# EAGLE design xmega_ethernet (EAGLE 6.6.0)
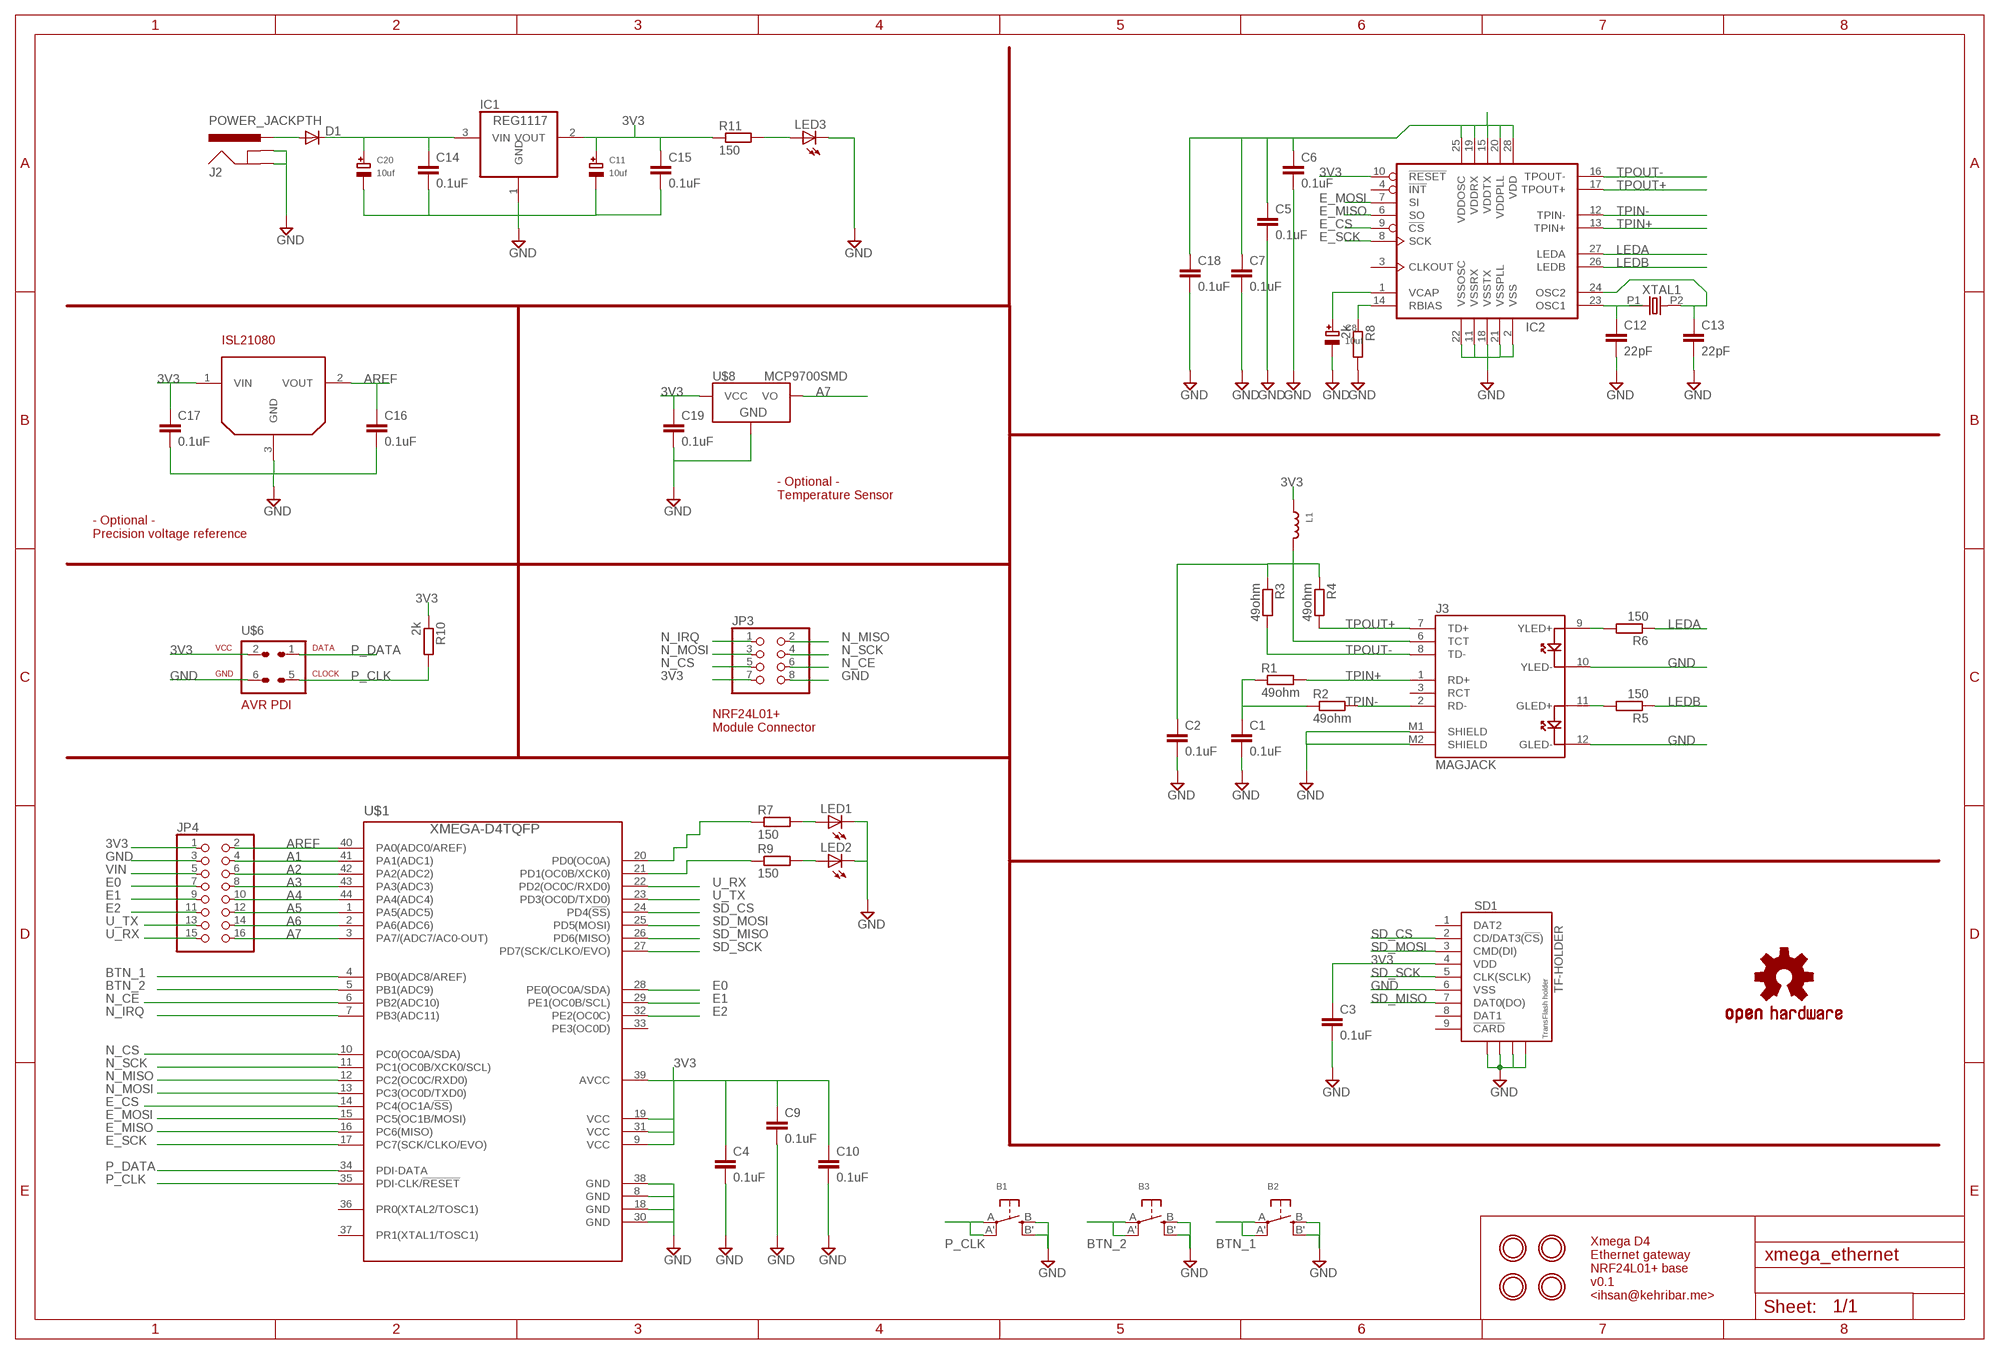
[diagram p0: schematic, sheet 1]

## Parts
B1  SWITCH_TACT_SMT4.6X2.8  [BTN_KMR2_4.6X2.8]
B2  SWITCH_TACT_SMT4.6X2.8  [BTN_KMR2_4.6X2.8]
B3  SWITCH_TACT_SMT4.6X2.8  [BTN_KMR2_4.6X2.8]
C1  0.1uF  C-EUC0805  [C0805]
C2  0.1uF  C-EUC0805  [C0805]
C3  0.1uF  C-EUC0805  [C0805]
C4  0.1uF  C-EUC0805  [C0805]
C5  0.1uF  C-EUC0805  [C0805]
C6  0.1uF  C-EUC0805  [C0805]
C7  0.1uF  C-EUC0805  [C0805]
C8  10uf  CAP_TANTALUMB/3528_WAVE  [EIA3528-21/B-W]
C9  0.1uF  C-EUC0805  [C0805]
C10  0.1uF  C-EUC0805  [C0805]
C11  10uf  CAP_TANTALUMB/3528_WAVE  [EIA3528-21/B-W]
C12  22pF  C-EUC0805  [C0805]
C13  22pF  C-EUC0805  [C0805]
C14  0.1uF  C-EUC0805  [C0805]
C15  0.1uF  C-EUC0805  [C0805]
C16  0.1uF  C-EUC0805  [C0805]
C17  0.1uF  C-EUC0805  [C0805]
C18  0.1uF  C-EUC0805  [C0805]
C19  0.1uF  C-EUC0805  [C0805]
C20  10uf  CAP_TANTALUMB/3528_WAVE  [EIA3528-21/B-W]
D1  DIODE1N4148  [DIODE-1N4148]
IC1  REG1117  [SOT223]
IC2  IC_ENC28J60-SOIC-28  [SOIC-28W]
J2  POWER_JACKPTH  [POWER_JACK_PTH]
J3  MAGJACK  [MAGJACK]
JP3  PINHD-2X4  [2X04]
JP4  PINHD-2X8  [2X08]
L1  INDUCTOR0805  [0805]
LED1  LED-0805  [LED-805]
LED2  LED-0805  [LED-805]
LED3  LED-0805  [LED-805]
LOGO1  OSHW-LOGOM  [OSHW-LOGO-M]
R1  49ohm  R-EU_R0805  [R0805]
R2  49ohm  R-EU_R0805  [R0805]
R3  49ohm  R-EU_R0805  [R0805]
R4  49ohm  R-EU_R0805  [R0805]
R5  150  R-EU_R0805  [R0805]
R6  150  R-EU_R0805  [R0805]
R7  150  R-EU_R0805  [R0805]
R8  2k  R-EU_R0805  [R0805]
R9  150  R-EU_R0805  [R0805]
R10  2k  R-EU_R0805  [R0805]
R11  150  R-EU_R0805  [R0805]
SD1  TF-HOLDER  [TF-PULL]
U$1  XMEGA-D4TQFP  [TQFP44]
U$2  MOUNTINGHOLE3.0THIN  [MOUNTINGHOLE_3.0_PLATEDTHIN]
U$3  MOUNTINGHOLE3.0THIN  [MOUNTINGHOLE_3.0_PLATEDTHIN]
U$4  MOUNTINGHOLE3.0THIN  [MOUNTINGHOLE_3.0_PLATEDTHIN]
U$5  MOUNTINGHOLE3.0THIN  [MOUNTINGHOLE_3.0_PLATEDTHIN]
U$6  AVR-PDIVERT  [AVR-ISP-6]
U$7  IHSAN_ISL21080  [SOT23-3]
U$8  MCP9700SMD  [SOT23-3]
XTAL1  OSC-XTAL-HC-49U-PTH  [HC-49U-PTH]

## Nets
3V3: C3.1 C4.1 C5.1 C6.1 C7.1 C9.1 C10.1 C11.+ C15.1 C17.1 C18.1 C19.1 IC1.2(VOUT) IC2.10(!RESET) IC2.15(VDDTX) IC2.19(VDDRX) IC2.20(VDDPLL) IC2.25(VDDOSC) IC2.28(VDD) JP3.7 JP4.1 L1.1 R10.1 R11.1 SD1.4(VDD) U$1.9(VCC) U$1.19(VCC) U$1.31(VCC) U$1.39(AVCC) U$6.2 U$7.1(VIN) U$8.1(VCC)
A1: JP4.4 U$1.41(PA1(ADC1))
A2: JP4.6 U$1.42(PA2(ADC2))
A3: JP4.8 U$1.43(PA3(ADC3))
A4: JP4.10 U$1.44(PA4(ADC4))
A5: JP4.12 U$1.1(PA5(ADC5))
A6: JP4.14 U$1.2(PA6(ADC6))
A7: JP4.16 U$1.3(PA7/(ADC7/AC0-OUT)) U$8.2(VO)
AREF: C16.1 JP4.2 U$1.40(PA0(ADC0/AREF)) U$7.2(VOUT)
BTN_1: B2.A'(P1) B2.A(P) U$1.4(PB0(ADC8/AREF))
BTN_2: B3.A'(P1) B3.A(P) U$1.5(PB1(ADC9))
E0: JP4.7 U$1.28(PE0(OC0A/SDA))
E1: JP4.9 U$1.29(PE1(OC0B/SCL))
E2: JP4.11 U$1.32(PE2(OC0C))
E_CS: IC2.9(!CS) U$1.14(PC4(OC1A/!SS!))
E_MISO: IC2.6(SO) U$1.16(PC6(MISO))
E_MOSI: IC2.7(SI) U$1.15(PC5(OC1B/MOSI))
E_SCK: IC2.8(SCK) U$1.17(PC7(SCK/CLKO/EVO))
GND: B1.B'(S1) B1.B(S) B2.B'(S1) B2.B(S) B3.B'(S1) B3.B(S) C1.2 C2.2 C3.2 C4.2 C5.2 C6.2 C7.2 C8.- C9.2 C10.2 C11.- C12.2 C13.2 C14.2 C15.2 C16.2 C17.2 C18.2 C19.2 C20.- IC1.1(GND) IC2.2(VSS) IC2.11(VSSRX) IC2.18(VSSTX) IC2.21(VSSPLL) IC2.22(VSSOSC) J2.GND J2.GNDBREAK J3.10(YLED-) J3.12(GLED-) J3.M1(SHIELD) J3.M2(SHIELD) JP3.8 JP4.3 LED1.C LED2.C LED3.C R8.2 SD1.6(VSS) SD1.S1 SD1.S2 SD1.S3 SD1.S4 U$1.8(GND) U$1.18(GND) U$1.30(GND) U$1.38(GND) U$6.6 U$7.3(GND) U$8.3(GND)
LEDA: IC2.27(LEDA) R6.1
LEDB: IC2.26(LEDB) R5.1
N$1: C1.1 R1.1 R2.1
N$2: J3.9(YLED+) R6.2
N$3: C13.1 IC2.24(OSC2) XTAL1.P2
N$4: J3.11(GLED+) R5.2
N$5: C12.1 IC2.23(OSC1) XTAL1.P1
N$7: C2.1 J3.6(TCT) L1.2 R3.1 R4.1
N$10: C8.+ IC2.1(VCAP)
N$13: IC2.14(RBIAS) R8.1
N$17: R7.1 U$1.20(PD0(OC0A))
N$18: R9.1 U$1.21(PD1(OC0B/XCK0))
N$19: LED1.A R7.2
N$20: LED2.A R9.2
N$21: D1.A J2.PWR
N$24: LED3.A R11.2
N_CE: JP3.6 U$1.6(PB2(ADC10))
N_CS: JP3.5 U$1.10(PC0(OC0A/SDA))
N_IRQ: JP3.1 U$1.7(PB3(ADC11))
N_MISO: JP3.2 U$1.12(PC2(OC0C/RXD0))
N_MOSI: JP3.3 U$1.13(PC3(OC0D/TXD0))
N_SCK: JP3.4 U$1.11(PC1(OC0B/XCK0/SCL))
P_CLK: B1.A'(P1) B1.A(P) R10.2 U$1.35(PDI-CLK/!RESET) U$6.5
P_DATA: U$1.34(PDI-DATA) U$6.1
SD_CS: SD1.2(CD/DAT3(!CS!)) U$1.24(PD4(!SS!))
SD_MISO: SD1.7(DAT0(DO)) U$1.26(PD6(MISO))
SD_MOSI: SD1.3(CMD(DI)) U$1.25(PD5(MOSI))
SD_SCK: SD1.5(CLK(SCLK)) U$1.27(PD7(SCK/CLKO/EVO))
TPIN+: IC2.13(TPIN+) J3.1(RD+) R1.2
TPIN-: IC2.12(TPIN-) J3.2(RD-) R2.2
TPOUT+: IC2.17(TPOUT+) J3.7(TD+) R4.2
TPOUT-: IC2.16(TPOUT-) J3.8(TD-) R3.2
U_RX: JP4.15 U$1.22(PD2(OC0C/RXD0))
U_TX: JP4.13 U$1.23(PD3(OC0D/TXD0))
VIN: C14.1 C20.+ D1.C IC1.3(VIN) JP4.5
Unconnected: IC2.3(CLKOUT) IC2.4(!INT) J3.3(RCT) SD1.1(DAT2) SD1.8(DAT1) SD1.9(!CARD) U$1.33(PE3(OC0D)) U$1.36(PR0(XTAL2/TOSC1)) U$1.37(PR1(XTAL1/TOSC1))

## Notes on the sheet
- - Optional -
  Temperature Sensor
- - Optional -
  Precision voltage reference
- NRF24L01+
  Module Connector
- Xmega D4 
  Ethernet gateway
  NRF24L01+ base
  v0.1
  <ihsan@kehribar.me>

## Library data of the parts
B1-B3 = microbuilder:SWITCH_TACT_SMT: SMT Tact Switches 6x6mm - Digikey: P12940SCT-ND KMR2 (4.6x2.8mm) - Digikey: 401-1426-1-ND EVQ-PQHB55 - Light Touch, 160GF (4.5x4.5mm) - Digikey: P8090SCT-ND
C1-C7 C9 C10 C12-C19 = rcl:C-EU: CAPACITOR, European symbol
C8 C11 C20 = microbuilder:CAP_TANTALUM: Tantalum Capacitors Wave footprints have larger pads and are meant to be used for hand soldering. Reflow footprints are optimised for solder paste and a reflow oven. EIA3216-18/A-[R/W] - Size A / 3216-18 / 1206 footprint 4.7µF 25V 10% Tantalum Capacitor 10µF 16V 10% Tantalum Capacitor [Digikey: 495-2236-2-ND] EIA3528-21/B-[R/W] - Size B / 3528-21 47µF 10V 10% Tantalum Capactior [Digikey: 495-2216-1-ND] EIA6032-28/C-[R/W] - Size C / 6032-28 10µF 35V 20% Tantalum Capacitor [Digikey: 495-2285-1-ND] 100µF 16V 10% Tantalum Capactior [Digikey: 399-5214-1-ND]
D1 = SparkFun-DiscreteSemi:DIODE: Diode These are standard reverse protection diodes and small signal diodes. SMA package can handle up to about 1A. SOD-323 can handle about 200mA. What the SOD-323 package when ordering, there are some mfgs out there that are 5-pin packages.
IC1 = burr-brown:REG1117: 800mA and 1A Low Dropout (LDO) Positive Regulator 1.8V, 2.5V, 2.85V, 3.3V, 5V, and Adj; MPN: REG1117; OC_FARNELL: 1097566; OC_NEWARK: 14P6981
IC2 = dp_devices:IC_ENC28J60: Ethernet Controller with SPI Interface
J2 = SparkFun-Connectors:POWER_JACK: Power Jack This is the standard 5.5mm barrel jack for power. The PTH is the most common, proven, reliable, footprint. The Slot footprint only works if the mill layer is transmitted to the PCB fab house so be warned. Spark Fun Electronics SKU : PRT-00119 SMT: CONN-08106 Mating wall wart : TOL-00298 (and others)
J3 = SparkFun-Connectors:MAGJACK: RJ-45 with LEDs
JP3 = pinhead:PINHD-2X4: PIN HEADER
JP4 = pinhead:PINHD-2X8: PIN HEADER
L1 = microbuilder:INDUCTOR: Inductors 0603: 10nH Ceramic Inductor - microwire antenna/RF (Digikey: 712-1434-2-ND) 0805: 560nH Ceramic Inductor - RF (Digikey: 553-1047-1-ND) 270nH Ceramic Inductor - Q = 40@250MHz, +-5%, 1 Ohm DC Resistance (Digikey: 535-10506-2-ND) 1007 (2518 Metric) SMT: 10µH 10% 250mOhm 820mA 1007 Inductor (Digikey: 587-2189-1-ND) 22µH 10% 500mOhm 580mA 1007 Inductor (Digikey: 587-2190-1-ND) 47µH 10% 950mOhm 420mA 1007 Inductor (Digikey: 587-2191-1-ND) 47µH 5% 100mOhm 1A 1008 Inductor (Digikey: 732-1816-1-ND) 5.0x5.0mm (Taiyo Yuden NR5040 Series) 6.8µH 20% 2.3A 64mOhm Inductor (Digikey: 587-2374-2-ND) 5.0x5.0mm (TDK VLC5045 Series) 4.7µH 20% 3.3A 34mOhm Inductor (Digikey: 445-6526-1-ND) 6.8µH 20% 2.7A 46mOhm Inductor (Digikey: 445-6527-1-ND) 6.0x6.0mm (TDK VLC6045 Series) 4.7µH 20% 3.8A 27mOhm Inductor (Digikey: 445-6538-2-ND) 6.8µH 20% 3A 41mOhm Inductor (Digikey: 445-6540-1-ND) 6.2µH 30% 2.2A 45mOhm Inductor (Digikey: SRR5028-6R2YCT-ND) - Not TDK VLC6045 but footprint should match 6.0x6.0mm (TDK SLF6045 Series) 6.8uH 30% 2A 33mOhm Inductor (Digikey: 445-4572-1-ND, Mouser: 810-SLF645T6R8N2R0PF)
LED1-LED3 = dp_devices:LED: Light Emitting Diode
LOGO1 = SparkFun-Aesthetics:OSHW-LOGO: Open Source Hardware Logo This logo indicates the piece of hardware it is found on incorporates a OSHW license and/or adheres to the definition of open source hardware found here: http://freedomdefined.org/OSHW
R1-R11 = rcl:R-EU_: RESISTOR, European symbol
SD1 = transflash:TF-HOLDER: TF / Micro SD socket is PUSH-PUSH type, the card can be pushed into and auto locked and pushed out by simply press the card. Surface Mounting type.
U$1 = avr-7:XMEGA-D4: Atmel AVR XMega D4 series processor
U$2-U$5 = microbuilder:MOUNTINGHOLE: Mounting Hole For #2 screws (0.086"/2.18mm width, 0.094"/2.4mm hole) use 2.5mm
U$6 = avr-7:AVR-PDI: AVR PDI programming interface connector
U$7 = SparkFun-DigitalIC_ihsan:IHSAN_ISL21080
U$8 = SparkFun-Sensors:MCP9700: Analog-output temperature sensor
XTAL1 = dp_devices:OSC-XTAL

## Board
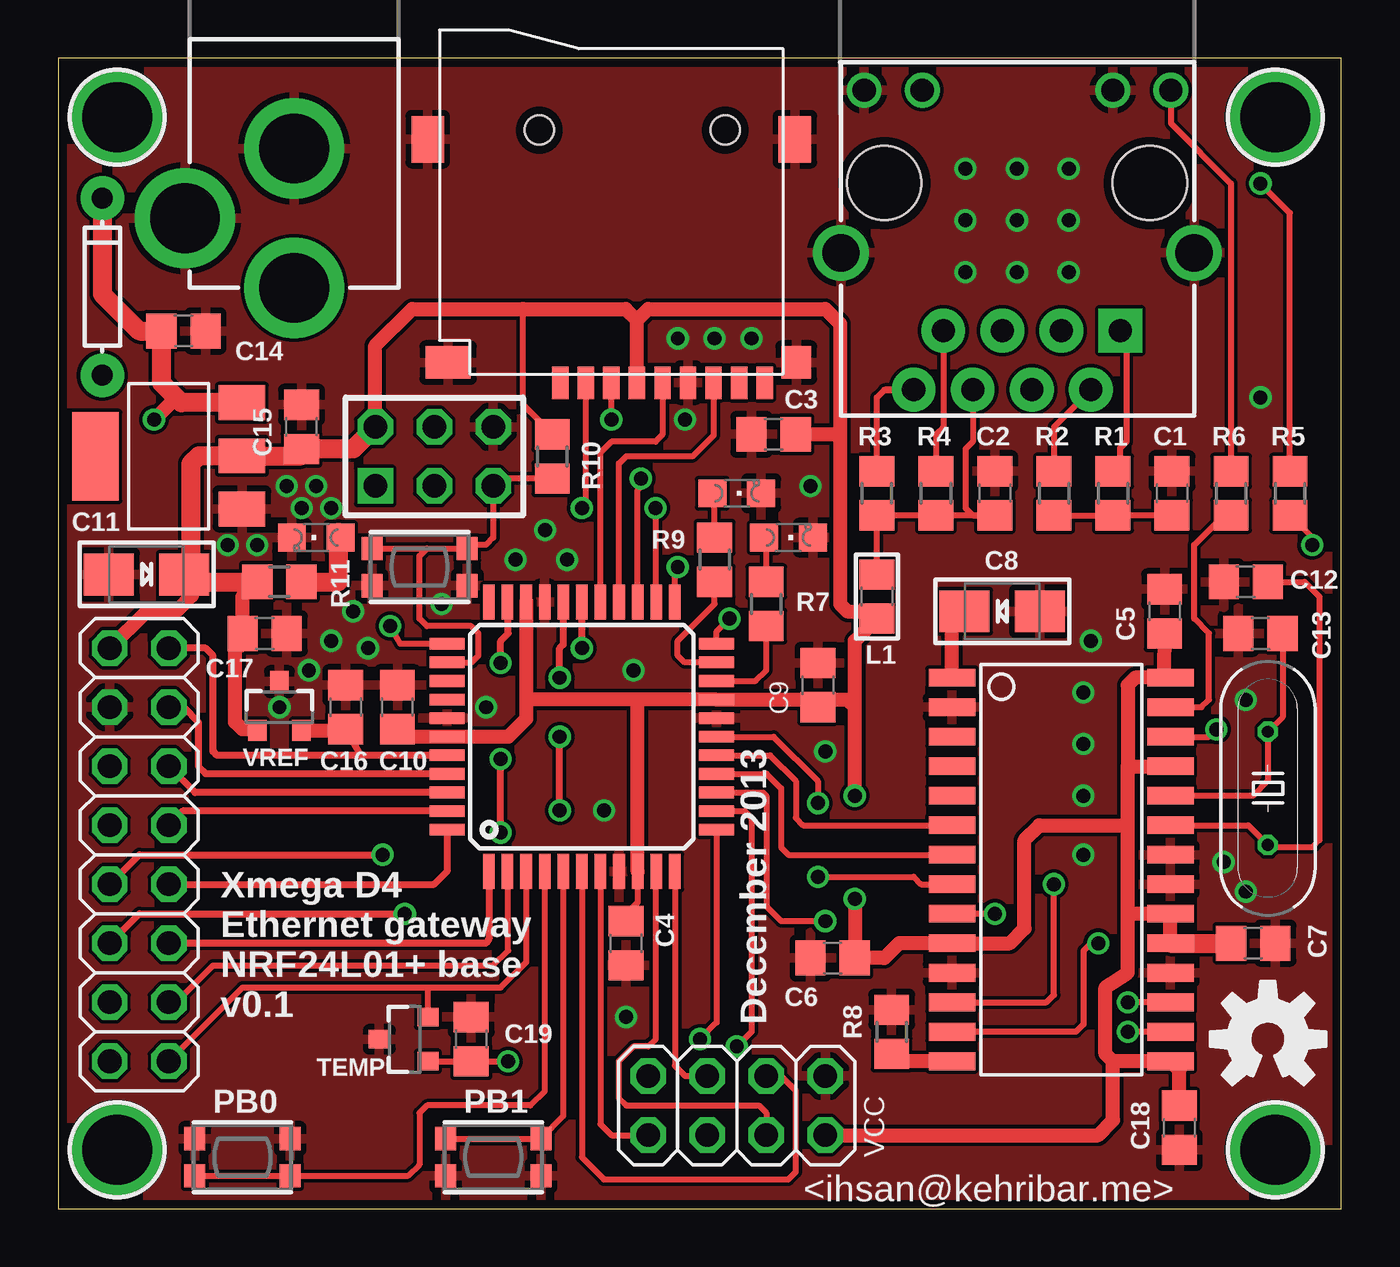
[diagram p1: board, top side]
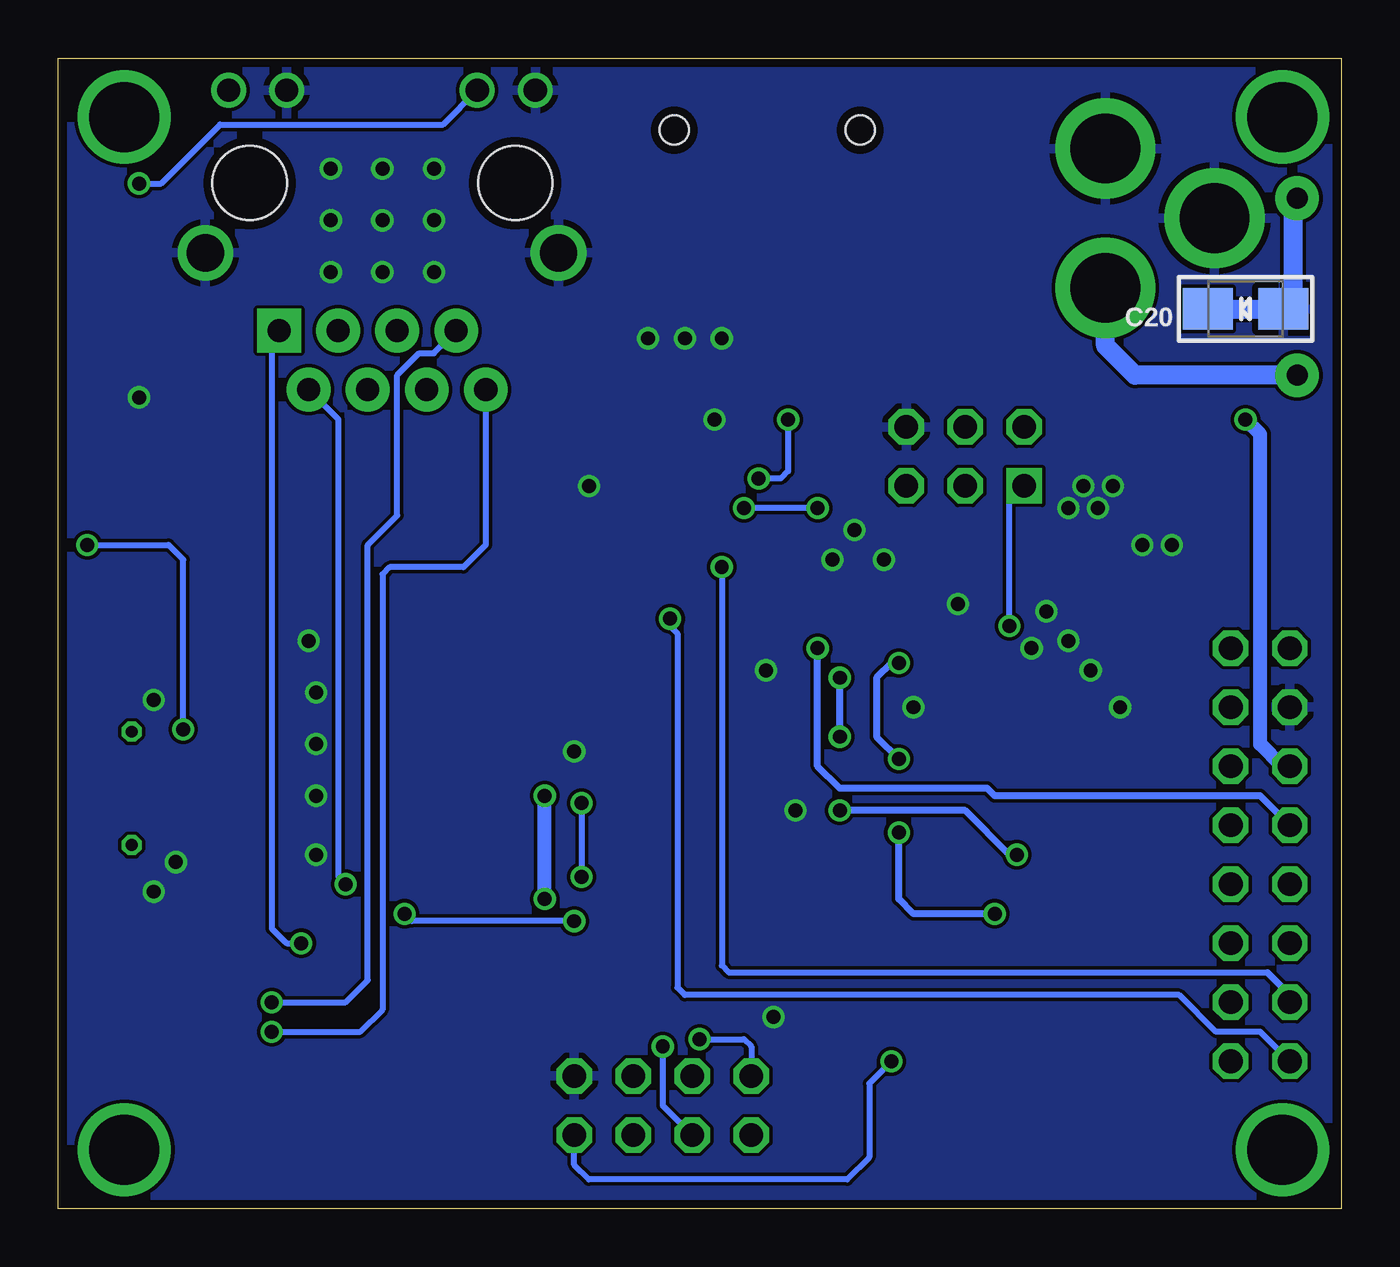
[diagram p2: board, bottom side, seen from below]

Size 55.23 x 49.52 mm. Coordinates in mm from the lower left corner, seen from the top.
Outline: 0,49.52 0,0 55.23,0 55.23,49.52 0,49.52
Copper layers (1*16): Top 0.0356mm / dielectric 1.5011mm / Bottom 0.0356mm
Design rules "LaenPCBOrder": minimum track width 6mil, minimum drill 13mil, track to track 6mil, track to pad 6mil, pad to pad 6mil, via to via 6mil, smd to smd 6mil, copper to edge 15mil, drill to drill 6mil, minimum pad ring 7mil, minimum via ring 7mil, stop-mask expansion 4mil, vias tented up to drill 0mil, thermal gap 10mil

### Footprints (pad centres in the part's own frame; a part is rotated, then mirrored left to right if it is on the bottom)
BTN_KMR2_4.6X2.8 = smd 0.9 x 1: A 2.05,0.8; A' -2.05,0.8; B 2.05,-0.8; B' -2.05,-0.8
C0805 = smd 1.3 x 1.5: 1 -0.95,0; 2 0.95,0
EIA3528-21/B-W = smd 2.15 x 1.8: + 1.625,0; - -1.625,0
DIODE-1N4148 = drill 0.9 pad 1.88: A -3.81,0; C 3.81,0
SOT223 = smd 1.499 x 2.007: 1 -2.261,-3.15; 2 0.025,-3.15; 3 2.311,-3.15 | smd 3.81 x 2.007: 4 0,3.15
SOIC-28W = smd 0.762 x 2: 1 -8.89,-4.7; 2 -7.62,-4.7; 3 -6.35,-4.7; 4 -5.08,-4.7; 5 -3.81,-4.7; 6 -2.54,-4.7; 7 -1.27,-4.7; 8 0,-4.7; 9 1.27,-4.7; 10 2.54,-4.7; 11 3.81,-4.7; 12 5.08,-4.7; 13 6.35,-4.7; 14 7.62,-4.7; 15 7.62,4.7; 16 6.35,4.7; 17 5.08,4.7; 18 3.81,4.7; 19 2.54,4.7; 20 1.27,4.7; 21 0,4.7; 22 -1.27,4.7; 23 -2.54,4.7; 24 -3.81,4.7; 25 -5.08,4.7; 26 -6.35,4.7; 27 -7.62,4.7; 28 -8.89,4.7
POWER_JACK_PTH = drill 2.997 pad 4.318: GND 0,7.7; GNDBREAK 4.7,10.7; PWR 0,13.7
MAGJACK = drill 1 pad 1.88 square: 1 3.175,17.445 | drill 1 pad 1.88: 2 4.445,19.985; 3 5.715,17.445; 4 6.985,19.985; 5 8.255,17.445; 6 9.525,19.985; 7 10.795,17.445; 8 12.065,19.985 | drill 1 pad 1.27: 9 1,7.1; 10 3.5,7.1; 11 11.7,7.1; 12 14.2,7.1 | drill 1.6 pad 2.184: M1 0,14.1; M2 15.2,14.1 | hole 3.2: 1.905,11.095; 13.335,11.095
2X04 = drill 1.016 octagon: 1 -3.81,-1.27; 2 -3.81,1.27; 3 -1.27,-1.27; 4 -1.27,1.27; 5 1.27,-1.27; 6 1.27,1.27; 7 3.81,-1.27; 8 3.81,1.27
2X08 = drill 1.016 octagon: 1 -8.89,-1.27; 2 -8.89,1.27; 3 -6.35,-1.27; 4 -6.35,1.27; 5 -3.81,-1.27; 6 -3.81,1.27; 7 -1.27,-1.27; 8 -1.27,1.27; 9 1.27,-1.27; 10 1.27,1.27; 11 3.81,-1.27; 12 3.81,1.27; 13 6.35,-1.27; 14 6.35,1.27; 15 8.89,-1.27; 16 8.89,1.27
0805 = smd 1.3 x 1.5: 1 -0.95,0; 2 0.95,0
LED-805 = smd 1.2 x 1.2: A 0,-1.05; C 0,1.05
R0805 = smd 1.3 x 1.5: 1 -0.95,0; 2 0.95,0
TF-PULL = smd 0.7 x 1.4: 1 -2.2,-7.62; 2 -1.1,-7.62; 3 0,-7.62; 4 1.1,-7.62; 5 2.2,-7.62; 6 3.3,-7.62; 7 4.4,-7.62; 8 5.5,-7.62; 9 6.6,-7.62 | smd 1.4 x 2: S1 -7.9,2.85; S2 7.9,2.85 | smd 1.28 x 1.4: S3 7.96,-6.75 | smd 1.95 x 1.4: S4 -7.025,-6.75 | hole 1.25: -3.1,3.25; 4.9,3.25
TQFP44 = smd 1.5 x 0.5: 1 -5.8,4; 2 -5.8,3.2; 3 -5.8,2.4; 4 -5.8,1.6; 5 -5.8,0.8; 6 -5.8,0; 7 -5.8,-0.8; 8 -5.8,-1.6; 9 -5.8,-2.4; 10 -5.8,-3.2; 11 -5.8,-4; 23 5.8,-4; 24 5.8,-3.2; 25 5.8,-2.4; 26 5.8,-1.6; 27 5.8,-0.8; 28 5.8,0; 29 5.8,0.8; 30 5.8,1.6; 31 5.8,2.4; 32 5.8,3.2; 33 5.8,4 | smd 0.5 x 1.5: 12 -4,-5.8; 13 -3.2,-5.8; 14 -2.4,-5.8; 15 -1.6,-5.8; 16 -0.8,-5.8; 17 0,-5.8; 18 0.8,-5.8; 19 1.6,-5.8; 20 2.4,-5.8; 21 3.2,-5.8; 22 4,-5.8; 34 4,5.8; 35 3.2,5.8; 36 2.4,5.8; 37 1.6,5.8; 38 0.8,5.8; 39 0,5.8; 40 -0.8,5.8; 41 -1.6,5.8; 42 -2.4,5.8; 43 -3.2,5.8; 44 -4,5.8
MOUNTINGHOLE_3.0_PLATEDTHIN = drill 3 pad 3.6: P$1 0,0
AVR-ISP-6 = drill 1.016 square: 1 -2.54,-1.27 | drill 1.016 octagon: 2 -2.54,1.27; 3 0,-1.27; 4 0,1.27; 5 2.54,-1.27; 6 2.54,1.27
SOT23-3 = smd 0.8 x 0.9: 1 -0.95,-1; 2 0.95,-1; 3 0,1.1
HC-49U-PTH = drill 0.508 octagon: P1 -2.44,0; P2 2.44,0

### Placement (x,y rotation side)
B1  15.56,27.61 0 top
B2  7.94,2.21 180 top
B3  18.73,2.21 0 top
C1  47.94,30.79 90 top
C2  40.32,30.79 90 top
C3  30.8,33.32 180 top
C4  24.45,11.42 270 top
C5  47.62,25.71 90 top
C6  33.34,10.78 180 top
C7  51.44,11.42 0 top
C8  40.64,25.71 180 top
C9  32.7,22.53 90 top
C10  14.61,21.58 90 top
C11  3.81,27.29 0 top
C12  51.12,26.98 180 top
C13  51.75,24.75 180 top
C14  5.4,37.77 0 top
C15  10.48,33.64 90 top
C16  12.38,21.58 90 top
C17  8.89,24.75 0 top
C18  48.26,3.48 270 top
C19  17.78,7.29 90 top
C20  4.13,38.72 180 bottom
D1  1.91,39.67 90 top
IC1  4.76,32.37 90 top
IC2  43.18,13.96 270 top
J2  10.16,53.33 180 top
J3  48.9,55.23 180 top
JP3  29.21,4.43 0 top
JP4  3.49,15.23 270 top
L1  35.24,26.34 90 top
LED1  31.43,28.88 270 top
LED2  29.21,30.79 270 top
LED3  11.11,28.88 90 top
LOGO1  52.07,7.29 0 top
R1  45.4,30.79 90 top
R2  42.86,30.79 90 top
R3  35.24,30.79 90 top
R4  37.78,30.79 90 top
R5  53.02,30.79 90 top
R6  50.48,30.79 90 top
R7  30.48,26.02 90 top
R8  35.88,7.61 90 top
R9  28.26,27.93 90 top
R10  21.27,32.37 270 top
R11  9.53,26.98 0 top
SD1  23.81,43.17 0 top
U$1  22.54,20.31 90 top
U$2  2.54,46.98 270 top
U$3  52.39,46.98 270 top
U$4  2.54,2.53 270 top
U$5  52.39,2.53 270 top
U$6  16.19,32.37 0 top
U$7  9.53,21.58 0 top
U$8  14.92,7.29 90 top
XTAL1  52.07,18.09 90 top

### Tracks (layer width: path | path; a pad name or v marks a point on that pad's centre or on a via)
3V3  (via drill 0.6)
  Top 0.254: 47.62,23.1 IC2.28 | L1.1 34.93,25.71 | 20.16,21.91 20.14,21.89 | 24.94,21.73 24.77,21.91 | C4.1 24.45,12.69 24.94,13.18 U$1.9 | 14.93,20.31 C10.1 | C9.1 32.7,21.91 | R10.1 20,34.6 20,38.72 | U$7.1 8.3,20.58 8.57,20.62 | 8.26,24.43 C17.1 | U$8.1 C19.1 19.05,6.34 v19.37,6.34
  Top 0.61: IC2.28 46.35,22.85 46.04,22.53 46.04,19.04 | 46.04,19.04 IC2.25 | IC2.19 IC2.20 46.04,12.69 | 46.04,12.69 46.04,10.15 45.09,9.51 45.09,6.66 45.4,6.34 | 46.04,12.69 46.04,16.5 | 46.04,16.5 46.04,19.04 | 45.4,6.34 IC2.15 48.26,5.96 C18.1 | 47.62,23.1 C5.1 | L1.1 34.29,24.44 34.29,21.58 | U$1.31 20.14,21.89 20.14,21.08 19.37,20.31 U$1.39 14.93,20.31 | 20.16,21.91 24.77,21.91 U$1.19 32.7,21.91 33.96,21.91 34.29,21.58 | U$1.9 24.94,21.73 | SD1.4 24.91,38.24 | 24.91,38.24 25.4,38.72 33.02,38.72 33.66,38.09 33.66,33.32 | 33.66,33.32 33.66,26.02 33.97,25.71 34.93,25.71 | v34.29,17.77 34.29,21.58 | C3.1 33.66,33.32 | v34.29,13.32 C6.1 35.56,10.78 36.2,11.42 IC2.10 40.96,11.42 41.59,12.05 41.59,15.86 42.23,16.5 46.04,16.5 | JP3.7 44.77,3.16 45.4,3.8 45.4,6.34 | U$6.2 13.65,37.14 15.24,38.72 20,38.72 24.43,38.72 24.91,38.24 | JP4.1 3.81,25.71 5.08,25.71 5.75,26.38 C11.+ | 8.57,20.62 7.94,20.62 7.62,20.94 7.62,24.12 8.26,24.43 | C17.1 7.94,26.34 R11.1
  Top 0.813: IC2.19 C7.1 | U$6.2 12.7,32.69 C15.1 10.46,32.4 IC1.2 6.06,32.4 5.71,32.06 5.71,27.33 C11.+ 5.75,27.25 6.03,26.98 R11.1
  Bottom 0.254: v19.37,6.34 20.32,5.38 20.32,2.21 21.27,1.26 32.38,1.26 33.02,1.89 JP3.7
  Bottom 0.61: v34.29,13.32 v34.29,17.77
A1
  Top 0.305: JP4.4 5.4,21.58 6.03,20.94 6.03,19.04 6.35,18.72 16.73,18.72 U$1.41
A2
  Top 0.305: U$1.42 5.89,17.91 JP4.6
A3
  Top 0.305: U$1.43 5.37,17.11 JP4.8
A4
  Top 0.305: JP4.10 16.19,13.96 16.74,14.51 U$1.44
A5
  Top 0.305: U$1.1 18.54,11.61 18.41,11.42 JP4.12
A6
  Top 0.254: JP4.14 5.08,8.88 6.67,10.46 18.73,10.46 19.37,11.1 19.37,14.48 U$1.2
A7
  Top 0.254: JP4.16 7.94,9.51 15.88,9.51 | 15.88,9.51 19.05,9.51 20.14,10.6 U$1.3 | U$8.2 15.92,9.46 15.88,9.51
AREF
  Top 0.254: 12.33,20.58 C16.1
  Top 0.305: U$1.40 13.02,19.51 | 13.02,19.51 6.83,19.51 6.67,19.67 6.67,23.8 6.35,24.12 JP4.2 | C16.1 13.02,19.51
  Top 0.61: U$7.2 12.33,20.58
BTN_1
  Top 0.254: U$1.4 20.94,5.05 20.32,4.43 15.88,4.43 15.56,4.12 15.56,1.89 15.07,1.41 B2.A' B2.A
BTN_2
  Top 0.254: B3.A' B3.A 21.74,3.97 U$1.5
E0  (via drill 0.6)
  Top 0.305: v22.54,24.12 U$1.28
  Bottom 0.305: JP4.7 3.49,17.77 14.92,17.77 15.24,18.09 21.59,18.09 22.54,19.04 v22.54,24.12
E1  (via drill 0.6)
  Top 0.305: JP4.9 3.49,15.23 v13.97,15.23 | v21.59,17.13 v21.59,20.31 | v21.59,22.85 21.59,24.12 21.74,24.27 U$1.29
  Bottom 0.305: v13.97,15.23 14.29,15.23 16.19,17.13 v21.59,17.13 | v21.59,20.31 v21.59,22.85
E2  (via drill 0.6)
  Top 0.305: JP4.11 3.49,12.69 v14.92,12.69 | v19.05,16.18 v19.05,19.35 | v19.05,23.48 19.05,24.44 19.37,24.75 19.37,26.08 U$1.32
  Bottom 0.305: v14.92,12.69 18.41,12.69 19.05,13.32 v19.05,16.18 | v19.05,23.48 19.37,23.48 20,22.85 20,20.31 v19.05,19.35
E_CS  (via drill 0.6)
  Top 0.254: v40.32,12.69 IC2.9 | U$1.14 30.34,17.91 30.48,17.77 30.48,13.01 31.11,12.37 v33.02,12.37
  Bottom 0.254: v33.02,12.37 40.01,12.37 v40.32,12.69
E_MISO
  Top 0.254: U$1.16 30.64,19.51 31.75,18.4 31.75,16.82 32.07,16.5 IC2.6
E_MOSI
  Top 0.254: U$1.15 30.49,18.71 31.11,18.09 31.11,15.54 31.43,15.23 IC2.7
E_SCK  (via drill 0.6)
  Top 0.254: U$1.17 30.8,20.31 32.7,18.4 v32.7,17.45 | v32.7,14.27 36.83,14.27 37.15,13.96 IC2.8
  Bottom 0.254: v32.7,17.45 v32.7,14.27
GND  (via drill 0.6)
  other vias: 51.12,21.89 44.45,24.44 44.13,22.21 44.13,19.99 50.16,14.91 51.12,13.64 44.13,17.77 44.13,15.23 43.5,44.75 41.27,44.75 39.05,44.75 43.5,42.53 41.27,42.53 39.05,42.53 43.5,40.31 41.27,40.31 39.05,40.31 29.84,37.45 28.26,37.45 26.67,37.45 26.99,33.96 23.5,17.13 24.77,23.16 33.02,19.67 32.38,31.1 24.45,8.24 18.41,21.58 51.75,34.91 9.84,31.1 11.11,31.1 10.48,30.15 11.75,30.15 7.3,28.56 8.57,28.56 20.95,29.2 16.51,26.02 13.34,24.12 10.79,23.16 9.53,21.58 12.7,25.71 11.75,24.44 19.68,27.93 21.91,27.93
  pour Bottom: 0,49.52 0,-0.01 55.24,-0.01 55.24,49.52
  pour Top: 0,49.52 0,-0.01 55.24,-0.01 55.24,49.52
LEDA
  Top 0.254: IC2.27 49.21,21.58 49.53,21.89 49.53,24.75 48.9,25.39 48.9,28.56 50.17,29.84 R6.1
LEDB  (via drill 0.6)
  Top 0.254: IC2.26 49.53,20.31 v49.85,20.62 | R5.1 53.98,28.88 v53.98,28.56
  Bottom 0.254: v49.85,20.62 49.85,27.93 50.48,28.56 v53.98,28.56
N$1
  Top 0.254: R2.1 R1.1 C1.1
N$2
  Top 0.254: J3.9 47.9,46.71 50.48,44.12 R6.2
N$3
  Top 0.254: IC2.24 51.44,17.77 52.07,18.4 XTAL1.P2 52.7,21.16 C13.1
N$4  (via drill 0.6)
  Top 0.254: R5.2 53.02,42.85 v51.75,44.12
  Bottom 0.254: v51.75,44.12 50.8,44.12 48.26,46.66 38.67,46.66 J3.11
N$5
  Top 0.254: IC2.23 51.22,16.5 XTAL1.P1 52.29,15.54 53.98,15.54 54.29,15.86 54.29,26.34 53.66,26.98 C12.1
N$7
  Top 0.254: J3.6 39.37,33.01 39.05,32.69 39.05,30.15 39.37,29.83 C2.1 R4.1 R3.1 L1.2
N$10
  Top 0.254: 38.48,25.17 C8.+
  Top 0.61: IC2.1 38.48,25.17
N$13
  Top 0.61: IC2.14 36.2,6.34 R8.1
N$17
  Top 0.254: U$1.20 30.02,22.71 30.48,23.16 R7.1
N$18
  Top 0.254: U$1.21 26.96,23.51 26.67,23.8 26.67,24.44 28.26,26.02 R9.1
N$19
  Top 0.254: R7.2 30.48,28.78 LED1.A
N$20
  Top 0.254: R9.2 28.26,30.69 LED2.A
N$21
  Bottom 0.813: D1.A 8.89,35.86 10.16,37.14 J2.PWR
N$24
  Top 0.813: R11.2 12.06,26.98 12.06,29.1 LED3.A
N_CE
  Top 0.254: U$1.6 22.54,2.21 23.5,1.26 31.43,1.26 31.75,1.57 31.75,5.07 31.11,5.7 JP3.6
N_CS
  Top 0.254: U$1.10 25.74,14.93 25.72,14.27 25.72,7.29 25.4,6.97 24.77,6.97 24.13,6.34 24.13,4.75 24.45,4.43 30.16,4.43 30.48,4.12 JP3.5
N_IRQ
  Top 0.254: U$1.7 23.34,3.63 23.81,3.16 JP3.1
N_MISO  (via drill 0.6)
  Top 0.254: U$1.12 28.34,8.01 v27.62,7.29
  Bottom 0.254: v27.62,7.29 25.72,7.29 25.4,6.97 JP3.2
N_MOSI  (via drill 0.6)
  Top 0.254: U$1.13 29.55,17.11 29.84,16.82 29.84,7.61 v29.21,6.97
  Bottom 0.254: v29.21,6.97 29.21,4.43 JP3.3
N_SCK
  Top 0.254: U$1.11 26.54,6.15 26.99,5.7 JP3.4
P_CLK
  Top 0.254: R10.2 19.05,31.42 U$6.5 18.73,28.88 18.41,28.56 17.76,28.56 B1.A 15.88,28.41 | B1.A' 15.88,28.41 | U$1.35 17.8,23.51 18.1,23.8 18.1,24.75 17.78,25.07 15.88,25.07 15.56,25.39 15.56,28.09 15.88,28.41
P_DATA  (via drill 0.6)
  Top 0.254: U$1.34 14.73,24.31 v14.29,25.07
  Bottom 0.254: v14.29,25.07 14.29,30.47 U$6.1
SD_CS  (via drill 0.6)
  Top 0.254: SD1.2 22.71,30.3 v22.54,30.15 | U$1.24 25.74,30.12 v25.72,30.15
  Bottom 0.254: v22.54,30.15 v25.72,30.15
SD_MISO
  Top 0.254: U$1.26 24.14,32.07 24.45,32.37 27.3,32.37 28.21,33.28 SD1.7
SD_MOSI  (via drill 0.6)
  Top 0.254: U$1.25 24.94,30.93 25.08,31.07 v25.08,31.42 | v23.81,33.96 SD1.3
  Bottom 0.254: v23.81,33.96 23.81,31.74 24.13,31.42 v25.08,31.42
SD_SCK
  Top 0.254: SD1.5 26.01,33.3 25.72,33.01 23.81,33.01 23.34,32.54 U$1.27
TPIN+  (via drill 0.6)
  Top 0.254: 45.72,32.37 45.72,32.05 R1.2 45.4,32.06 45.72,32.37 | v44.77,11.42 44.45,11.42 44.13,11.1 44.13,7.93 43.81,7.61 IC2.13 | 45.72,32.37 45.72,32.73 45.99,33.01 45.99,37.51 J3.1
  Bottom 0.254: v44.77,11.42 45.4,11.42 46.04,12.05 46.04,37.47 J3.1
TPIN-  (via drill 0.6)
  Top 0.254: J3.2 44.45,35.23 42.86,33.64 R2.2 | IC2.12 42.55,8.88 42.86,9.19 v42.86,13.96
  Bottom 0.254: J3.2 43.18,33.98 43.18,14.27 v42.86,13.96
TPOUT+  (via drill 0.6)
  Top 0.254: J3.7 38.1,33.64 37.78,33.32 R4.2 | IC2.17 v46.04,8.88
  Bottom 0.254: v46.04,8.88 42.86,8.88 41.91,9.83 41.91,28.56 40.64,29.83 40.64,35.86 39.69,36.82 39.07,36.82 J3.7
TPOUT-  (via drill 0.6)
  Top 0.254: J3.8 35.58,35.25 35.56,35.23 | R3.2 35.24,34.91 35.56,35.23 | 35.56,35.23 36.83,35.23 | IC2.16 v46.04,7.61
  Bottom 0.254: v46.04,7.61 42.23,7.61 41.27,8.56 41.27,27.29 40.96,27.61 37.78,27.61 36.83,28.56 J3.8
U_RX  (via drill 0.6)
  Top 0.254: U$1.22 28.34,24.84 v28.89,25.39
  Bottom 0.254: v28.89,25.39 28.89,25.07 28.57,24.75 28.57,9.51 28.26,9.19 6.99,9.19 5.4,7.61 3.49,7.61 JP4.15
U_TX  (via drill 0.6)
  Top 0.254: U$1.23 26.54,27.48 v26.67,27.61
  Bottom 0.254: v26.67,27.61 26.67,10.46 26.35,10.15 3.17,10.15
  Bottom 0.305: JP4.13 2.22,9.19 3.17,10.15
VIN  (via drill 0.6)
  Top 0.61: v4.13,33.96 5.08,34.91
  Top 0.813: D1.C 1.91,39.36 3.49,37.77 C14.1 4.45,35.55 5.08,34.91 5.31,34.68 IC1.3
  Bottom 0.61: JP4.5 2.54,19.04 3.49,19.99 3.49,33.32 v4.13,33.96
  Bottom 0.813: C20.+ 2.54,38.72 2.06,39.2 2.06,43.33 D1.C

### Text on the board
tPlace: VREF | Xmega D4 / Ethernet gateway / NRF24L01+ base / v0.1 | December 2013 | TEMP | PB0 | PB1 | VCC | <ihsan@kehribar.me>